# Altium project Pallet_end_node.PrjPcb
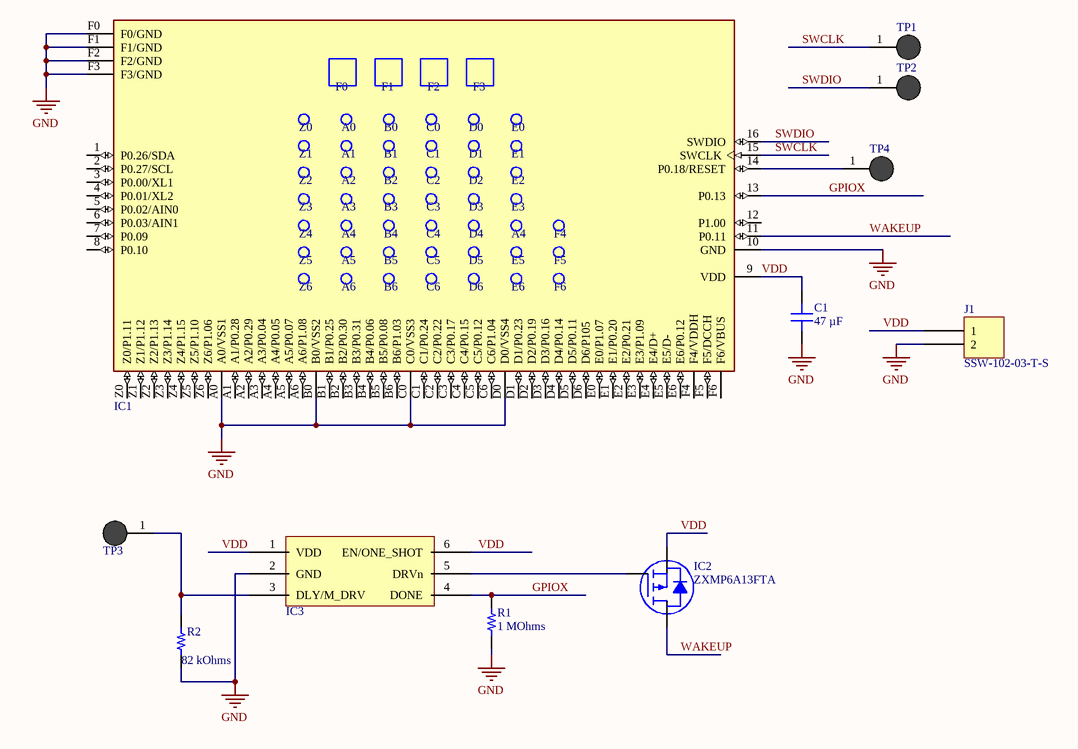
[diagram p0: Sheet1.SchDoc]
1 sheet, 11 parts. Net scope: global (net labels, ports and power ports of the same name join across sheets).
Board file: PCB1.PcbDoc

## Sheet Sheet1.SchDoc
size A4; SheetNumber: 1; SheetTotal: 1

### Parts
C1  47 µF  [CAP 1206_3216 - 0.8MM]
IC1  BT480F  [BT840F]  (value not drawn)
IC2  ZXMP6A13FTA  [DIODES SOT-23-3]
IC3  TPL5111DDCT  [SOT-23-THN-6]  (value not drawn)
J1  SSW-102-03-T-S  [SAMTEC SSW-102-03-T-S]
R1  1 MOhms  [RES 1206_3216]
R2  82 kOhms  [RES 1206_3216]
TP1  TEST PAD  [TEST_PAD]  (value not drawn)
TP2  TEST PAD  [TEST_PAD]  (value not drawn)
TP3  TEST PAD  [TEST_PAD]  (value not drawn)
TP4  TEST PAD  [TEST_PAD]  (value not drawn)

### Nets
GND: C1.1 IC1.10(GND) IC1.A0(A0/VSS1) IC1.B0(B0/VSS2) IC1.C0(C0/VSS3) IC1.D0(D0/VSS4) IC1.F0(F0/GND) IC1.F1(F1/GND) IC1.F2(F2/GND) IC1.F3(F3/GND) IC3.2(GND) J1.2 R1.1 R2.1
GPIOX: IC1.13(P0.13) IC3.4(DONE) R1.2
SWCLK: IC1.15(SWCLK) TP1.1
SWDIO: IC1.16(SWDIO) TP2.1
VDD: C1.2 IC1.9(VDD) IC2.2(S) IC3.1(VDD) IC3.6(EN/ONE_SHOT) J1.1
WAKEUP: IC1.11(P0.11) IC2.3(D)
NetIC1_14: IC1.14(P0.18/RESET) TP4.1
NetIC2_1: IC2.1(G) IC3.5(DRVn)
NetIC3_3: IC3.3(DLY/M_DRV) R2.2 TP3.1

Not connected (* = marked no-connect by the designer): IC1 1(P0.26/SDA) 2(P0.27/SCL) 3(P0.00/XL1) 4(P0.01/XL2) 5(P0.02/AIN0) 6(P0.03/AIN1) 7(P0.09) 8(P0.10) 12(P1.00) A1(A1/P0.28) A2(A2/P0.29) A3(A3/P0.04) A4(A4/P0.05) A5(A5/P0.07) A6(A6/P1.08) B1(B1/P0.25) B2(B2/P0.30) B3(B3/P0.31) B4(B4/P0.06) B5(B5/P0.08) B6(B6/P1.03) C1(C1/P0.24) C2(C2/P0.22) C3(C3/P0.17) C4(C4/P0.15) C5(C5/P0.12) C6(C6/P1.04) D1(D1/P0.23) D2(D2/P0.19) D3(D3/P0.16) D4(D4/P0.14) D5(D5/P0.11) D6(D6/P105) E0(E0/P1.07) E1(E1/P0.20) E2(E2/P0.21) E3(E3/P1.09) E4(E4/D+) E5(E5/D-) E6(E6/P0.12) F4(F4/VDDH) F5(F5/DCCH) F6(F6/VBUS) Z0(Z0/P1.11) Z1(Z1/P1.12) Z2(Z2/P1.13) Z3(Z3/P1.14) Z4(Z4/P1.15) Z5(Z5/P1.10) Z6(Z6/P1.06)

### Library data of the parts
C1 = GRM31CR61A476ME15L: CAP CER 47UF 10V X5R 1206; manufacturer: Murata Electronics; Tolerance: ±20%; Part Number: GRM31CR61A476ME15L; Value: 47 µF; Applications: General Purpose; Capacitance: 47 µF; componentlink1description: Datasheet; componentlink1url: https://www.murata.com/~/media/webrenewal/support/library/catalog/products/capacitor/mlcc/c02e.ashx?la=en-us; componentlink2description: DigiKey Link; componentlink2url: https://www.digikey.com/en/products/detail/murata-electronics/GRM31CR61A476ME15L/2334879; Device Package: 1206 (3216 Metric); lastupdated: 1.09.2022 12:38:50; Lifecycle Status: Active; Minimum Order: 1; Mounting Type: Surface Mount, MLCC; Operating Temperature: -55°C ~ 85°C; Package / Case: 1206 (3216 Metric); packaging: TapeAndReel; partid: 22110; Part Status: Active; price: 0.10; series: GRM; Size / Dimension: 0.126" L x 0.063" W (3.20mm x 1.60mm); Supplier 1: DigiKey; Supplier Part Number 1: 490-5528-1-ND; Temperature Coefficient: X5R; Thickness (Max): 0.071" (1.80mm); Voltage - Rated: 10V
IC1 = BT840F: BLE 5 Module: Nordic nRF52840 SoC (Range 930 Meters); Manufacturer: Fanstel; Designed by: Semih AŞÇI; Interface: SPI,USB; Frequency: 2.4GHz; Data Rate: 12Mbps; Sensitivity: -96dBm; Memory Size: 256KB; Supplier 1: Digi-Key; Manufacturer Part Number: BT840F; RoHS: No; Category: RF Receivers, Transceivers; Pricing 1: 1=14,04000, 10=12,70700, 25=11,70400, 100=10,70080, 250=10,03200, 500=9,36320 (USD); Mount: Surface Mount; Case/Package: SMD/SMT; Min Operating Temperature: -40°C; Max Operating Temperature: 85°C; Packaging: Tape and Reel; ComponentLink1URL: http://www.fanstel.com/s/BlueNor_BT840F_datasheets.pdf?src-supplier=Digi-Key; ComponentLink1Description: http://www.fanstel.com/s/BlueNor_BT840F_datasheets.pdf?src-supplier=Digi-Key; Supplier Part Number 1: 1914-1019-1-ND
IC2 = ZXMP6A13FTA: MOSFET P-CH 60V 0.9A SOT23-3; Manufacturer: Diodes Incorporated; Current - Continuous Drain (Id) @ 25°C: 900mA (Ta); Drive Voltage (Max Rds On,  Min Rds On): 4.5V, 10V; FET Type: P-Channel; Gate Charge (Qg) (Max) @ Vgs: 5.9nC @ 10V; Input Capacitance (Ciss) (Max) @ Vds: 219pF @ 30V; Power Dissipation (Max): 625mW (Ta); Rds On (Max) @ Id, Vgs: 400mOhm @ 900mA, 10V; Vgs (Max): ±20V; Vgs(th) (Max) @ Id: 3V @ 250µA; Part Number: ZXMP6A13FTA; ComponentLink1Description: Datasheet; ComponentLink1URL: https://www.diodes.com/assets/Datasheets/ZXMP6A13F.pdf; ComponentLink2Description: DigiKey Link; ComponentLink2URL: http://digikey.com/product-detail/en/diodes-incorporated/ZXMP6A13FTA/ZXMP6A13FCT-ND/560665; Drain to Source Voltage (Vdss): 60V; LastUpdated: 1.09.2022 13:23:38; Lifecycle Status: Active; Minimum Order: 1; Mounting Type: Surface Mount; Operating Temperature: -55°C ~ 150°C (TJ); Package / Case: TO-236-3, SC-59, SOT-23-3; Packaging: TapeAndReel; Part Status: Active; Price: 0.19; Series: -; Supplier 1: DigiKey; Supplier Part Number 1: ZXMP6A13FCT-ND; Supplier Device Package: SOT-23-3; Technology: MOSFET (Metal Oxide)
IC3 = TPL5111: Ultra low power system timer (35 nA) for power gating in duty cycled applications 6-SOT-23-THIN -40 to 105; Manufacturer: Texas Instruments; Operating Supply Current: 35nA; Min Supply Voltage: 1.8V; Max Supply Voltage: 5.5V; Designed by: Semih AŞÇI; Supplier 1: Digi-Key; Manufacturer Part Number: TPL5111DDCT; RoHS: Yes; Category: Real Time Clocks; Stock 1: 9273; Pricing 1: 1=1,25000, 10=1,11900, 25=1,06240, 100=0,87280 (USD); Mount: Surface Mount; Case/Package: SOT-23-6; Number of Pins: 6; Min Operating Temperature: -40°C; Max Operating Temperature: 105°C; Packaging: Cut Tape; Quiescent Current: 35nA; REACH SVHC: No SVHC; Lead Free: Lead Free; RoHS Compliant: Yes; ComponentLink1URL: http://www.ti.com/general/docs/lit/getliterature.tsp?genericPartNumber=TPL5111&amp;&amp;fileType=pdf&src-supplier=Farnell; ComponentLink1Description: http://www.ti.com/general/docs/lit/getliterature.tsp?genericPartNumber=TPL5111&amp;&amp;fileType=pdf&src-supplier=Farnell; ComponentLink2URL: http://www.ti.com/general/docs/lit/getliterature.tsp?genericPartNumber=TPL5111&&fileType=pdf&src-supplier=Element14; ComponentLink2Description: http://www.ti.com/general/docs/lit/getliterature.tsp?genericPartNumber=TPL5111&&fileType=pdf&src-supplier=Element14; ComponentLink3URL: http://www.ti.com/general/docs/lit/getliterature.tsp?genericPartNumber=TPL5111&&fileType=pdf&src-supplier=Farnell; ComponentLink3Description: http://www.ti.com/general/docs/lit/getliterature.tsp?genericPartNumber=TPL5111&&fileType=pdf&src-supplier=Farnell; ComponentLink4URL: http://www.ti.com/lit/ds/symlink/tpl5111.pdf?src-supplier=Digi-Key; ComponentLink4Description: http://www.ti.com/lit/ds/symlink/tpl5111.pdf?src-supplier=Digi-Key; ComponentLink5URL: http://www.ti.com/general/docs/suppproductinfo.tsp?distId=10&amp;gotoUrl=http%3A%2F%2Fwww.ti.com%2Flit%2Fgpn%2Ftpl5111&src-supplier=Digi-Key; ComponentLink5Description: http://www.ti.com/general/docs/suppproductinfo.tsp?distId=10&amp;gotoUrl=http%3A%2F%2Fwww.ti.com%2Flit%2Fgpn%2Ftpl5111&src-supplier=Digi-Key; Supplier Part Number 1: 296-42621-6-ND
J1 = SSW-102-03-T-S: CONN RCPT 2POS 0.1 TIN PCB; Manufacturer: Samtec Inc.; Connector Type: Receptacle; Current Rating (Amps): 5.7A per Contact; Material Flammability Rating: UL94 V-0; Number of Positions: 2; Number of Positions Loaded: All; Style: Board to Board or Cable; Part Number: SSW-102-03-T-S; ComponentLink2Description: DigiKey Link; ComponentLink2URL: http://digikey.com/product-detail/en/samtec-inc/SSW-102-03-T-S/SSW-102-03-T-S-ND/7873010; Contact Finish - Mating: Tin; Contact Finish - Post: Tin; Contact Type: Forked; Fastening Type: Push-Pull; Insulation Color: Black; LastUpdated: 21.06.2022 15:06:02; Lifecycle Status: Active; Minimum Order: 1; Mounting Type: Through Hole; Number of Rows: 1; Operating Temperature: -55°C ~ 105°C; Packaging: Bulk; Part Status: Active; Price: 0.53; Series: SSW; Supplier 1: DigiKey; Supplier Part Number 1: SSW-102-03-T-S-ND; Termination: Solder
R1 = RCA12061M00FKEA: RES SMD 1M OHM 1% 1/4W 1206; Manufacturer: Vishay Dale; Power (Watts): 0.25W, 1/4W; Temperature Coefficient: ±100ppm/°C; Part Number: RCA12061M00FKEA; ComponentLink1Description: Datasheet; ComponentLink1URL: http://www.vishay.com/docs/20037/rcae3.pdf; ComponentLink2Description: DigiKey Link; ComponentLink2URL: http://digikey.com/product-detail/en/vishay-dale/RCA12061M00FKEA/541-2251-1-ND/4946904; Composition: Thick Film; Device Package: 1206 (3216 Metric); Features: Anti-Sulfur, Automotive AEC-Q200; Height - Seated (Max): 0.024" (0.60mm); LastUpdated: 1.09.2022 12:59:13; Lifecycle Status: Active; Minimum Order: 1; Number of Terminations: 2; Operating Temperature: -55°C ~ 155°C; Package / Case: 1206 (3216 Metric); Packaging: TapeAndReel; PartId: 28528; Part Status: Active; Price: 0.01; Ratings: AEC-Q200; Resistance: 1 MOhms; Series: RCA; Size / Dimension: 0.126" L x 0.063" W (3.20mm x 1.60mm); Supplier 1: DigiKey; Supplier Part Number 1: 541-2251-1-ND; Supplier Device Package: 1206; Tolerance: ±1%; Value: 1 MOhms
R2 = CRGP1206F82K: RES 82K OHM 1% 1/2W 1206; Manufacturer: TE Connectivity Passive Product; Power (Watts): 0.5W, 1/2W; Temperature Coefficient: ±100ppm/°C; Part Number: CRGP1206F82K; ComponentLink1Description: Datasheet; ComponentLink1URL: https://www.te.com/commerce/DocumentDelivery/DDEController?Action=srchrtrv&DocNm=9-1773463-9&DocType=DS&DocLang=English; ComponentLink2Description: DigiKey Link; ComponentLink2URL: https://www.digikey.com/en/products/detail/te-connectivity-passive-product/CRGP1206F82K/8577163; Composition: Thick Film; Device Package: 1206 (3216 Metric); Features: Pulse Withstanding; Height - Seated (Max): 0.026" (0.65mm); LastUpdated: 1.09.2022 12:59:15; Lifecycle Status: Active; Minimum Order: 1; Number of Terminations: 2; Operating Temperature: -55°C ~ 155°C; Package / Case: 1206 (3216 Metric); Packaging: TapeAndReel; PartId: 27819; Part Status: Active; Price: 0.04; Resistance: 82 kOhms; Series: CRGP; Size / Dimension: 0.122" L x 0.061" W (3.10mm x 1.55mm); Supplier 1: DigiKey; Supplier Part Number 1: A130561CT-ND; Supplier Device Package: 1206; Tolerance: ±1%; Value: 82 kOhms